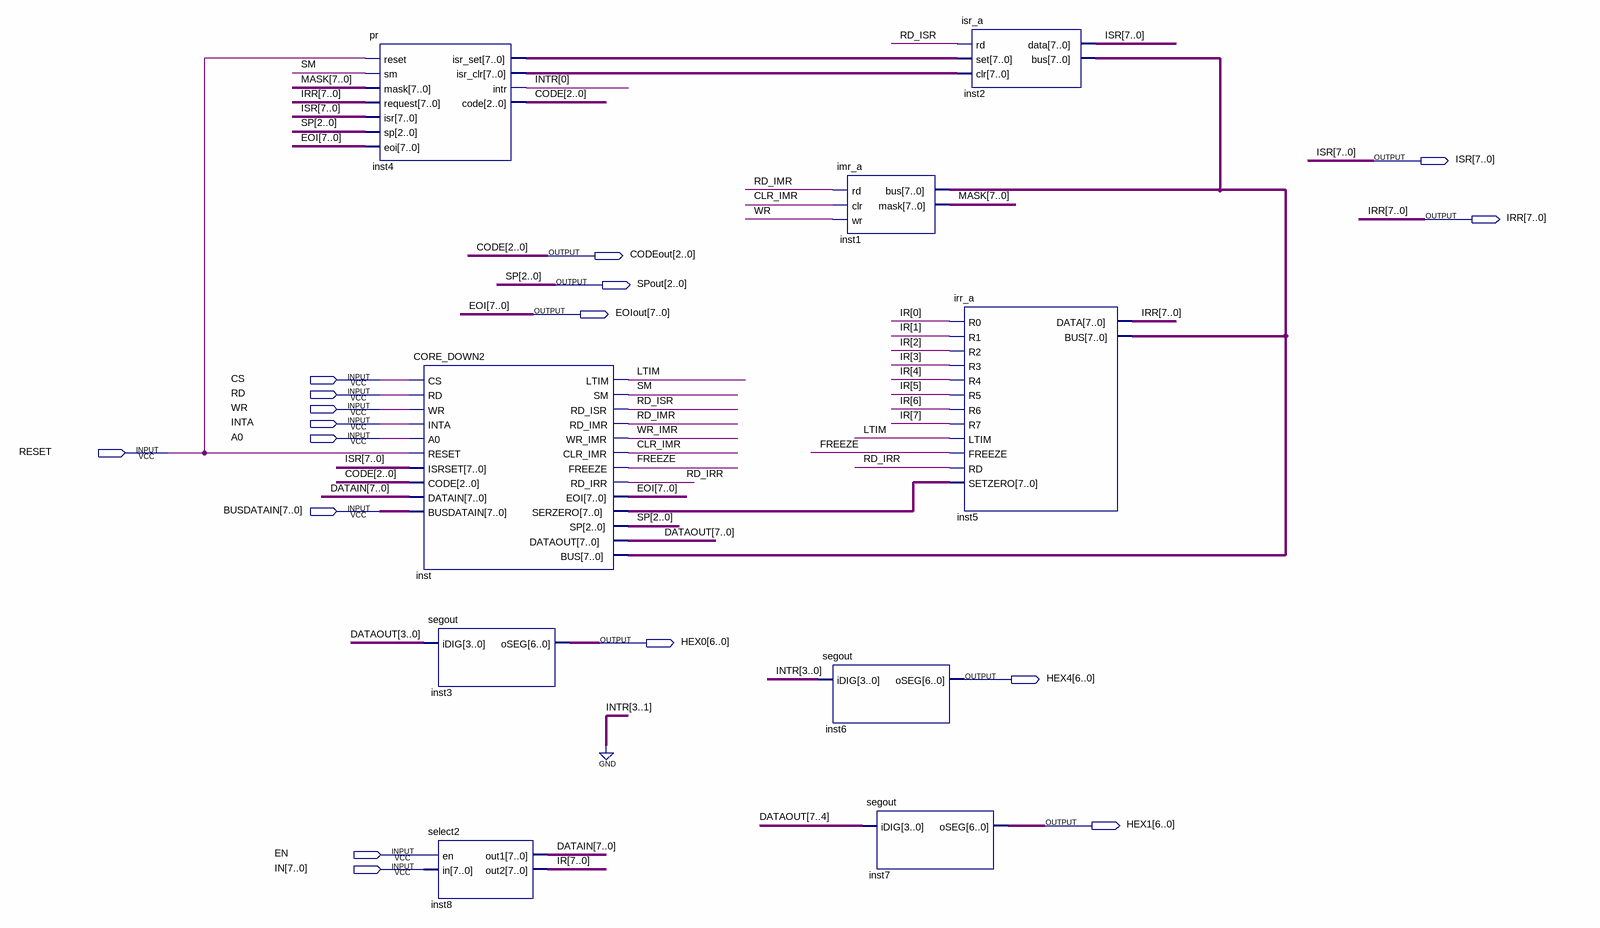
[diagram p0: schematic sheet]
// Quartus schematic 8259a_down.bdf as structural Verilog: 9 symbols, 17 pins
module \8259a_down  (
  input  CS,
  input  RD,
  input  WR,
  input  INTA,
  input  A0,
  input  RESET,
  input  [7:0] BUSDATAIN,
  input  EN,
  input  [7:0] IN,
  output [7:0] ISR,
  output [7:0] IRR,
  output [2:0] CODEout,
  output [2:0] SPout,
  output [7:0] EOIout,
  output [6:0] HEX0,
  output [6:0] HEX4,
  output [6:0] HEX1
);

  wire CLR_IMR, FREEZE, LTIM, RD_IMR, RD_IRR, RD_ISR, SM, WR_IMR;
  wire [0:0] INTR;
  wire [7:0] DATAIN, DATAOUT, inst4_isr_clr, inst4_isr_set, inst_bus, inst_serzero, IR, MASK;

  pr inst4 (
    .reset(RESET), .sm(SM), .mask(MASK), .request(IRR), .isr(ISR), .sp(SPout), .eoi(EOIout),
    .isr_set(inst4_isr_set), .isr_clr(inst4_isr_clr), .intr(INTR[0]), .code(CODEout));
  CORE_DOWN2 inst (
    .CS(CS), .RD(RD), .WR(WR), .INTA(INTA), .A0(A0), .RESET(RESET), .ISRSET(ISR), .CODE(CODEout),
    .DATAIN(DATAIN), .BUSDATAIN(BUSDATAIN), .LTIM(LTIM), .SM(SM), .RD_ISR(RD_ISR), .RD_IMR(RD_IMR),
    .WR_IMR(WR_IMR), .CLR_IMR(CLR_IMR), .FREEZE(FREEZE), .RD_IRR(RD_IRR), .EOI(EOIout),
    .SERZERO(inst_serzero), .SP(SPout), .DATAOUT(DATAOUT), .BUS(inst_bus));
  segout inst3 (.iDIG(DATAOUT[3:0]), .oSEG(HEX0));
  select2 inst8 (.en(EN), .in(IN), .out1(DATAIN), .out2(IR));
  imr_a inst1 (.rd(RD_IMR), .clr(CLR_IMR), .wr(WR), .mask(MASK), .bus(inst_bus));
  segout inst6 (.iDIG({3'b000, INTR[0]}), .oSEG(HEX4));
  segout inst7 (.iDIG(DATAOUT[7:4]), .oSEG(HEX1));
  isr_a inst2 (.rd(RD_ISR), .set(inst4_isr_set), .clr(inst4_isr_clr), .data(ISR), .bus(inst_bus));
  irr_a inst5 (
    .R0(IR[0]), .R1(IR[1]), .R2(IR[2]), .R3(IR[3]), .R4(IR[4]), .R5(IR[5]), .R6(IR[6]), .R7(IR[7]),
    .LTIM(LTIM), .FREEZE(FREEZE), .RD(RD_IRR), .SETZERO(inst_serzero), .DATA(IRR), .BUS(inst_bus));

  // Other names for the same wires on the sheet: CODE[2:0] = CODEout; EOI[7:0] = EOIout; SP[2:0] = SPout
endmodule
